# Altium schematic sheet STM32L476VE.SchDoc
size A3; ApprovedBy: WEILIANG; Author: WU&WEILIANG; Address1: NANJING; Address2: TAIYUAN
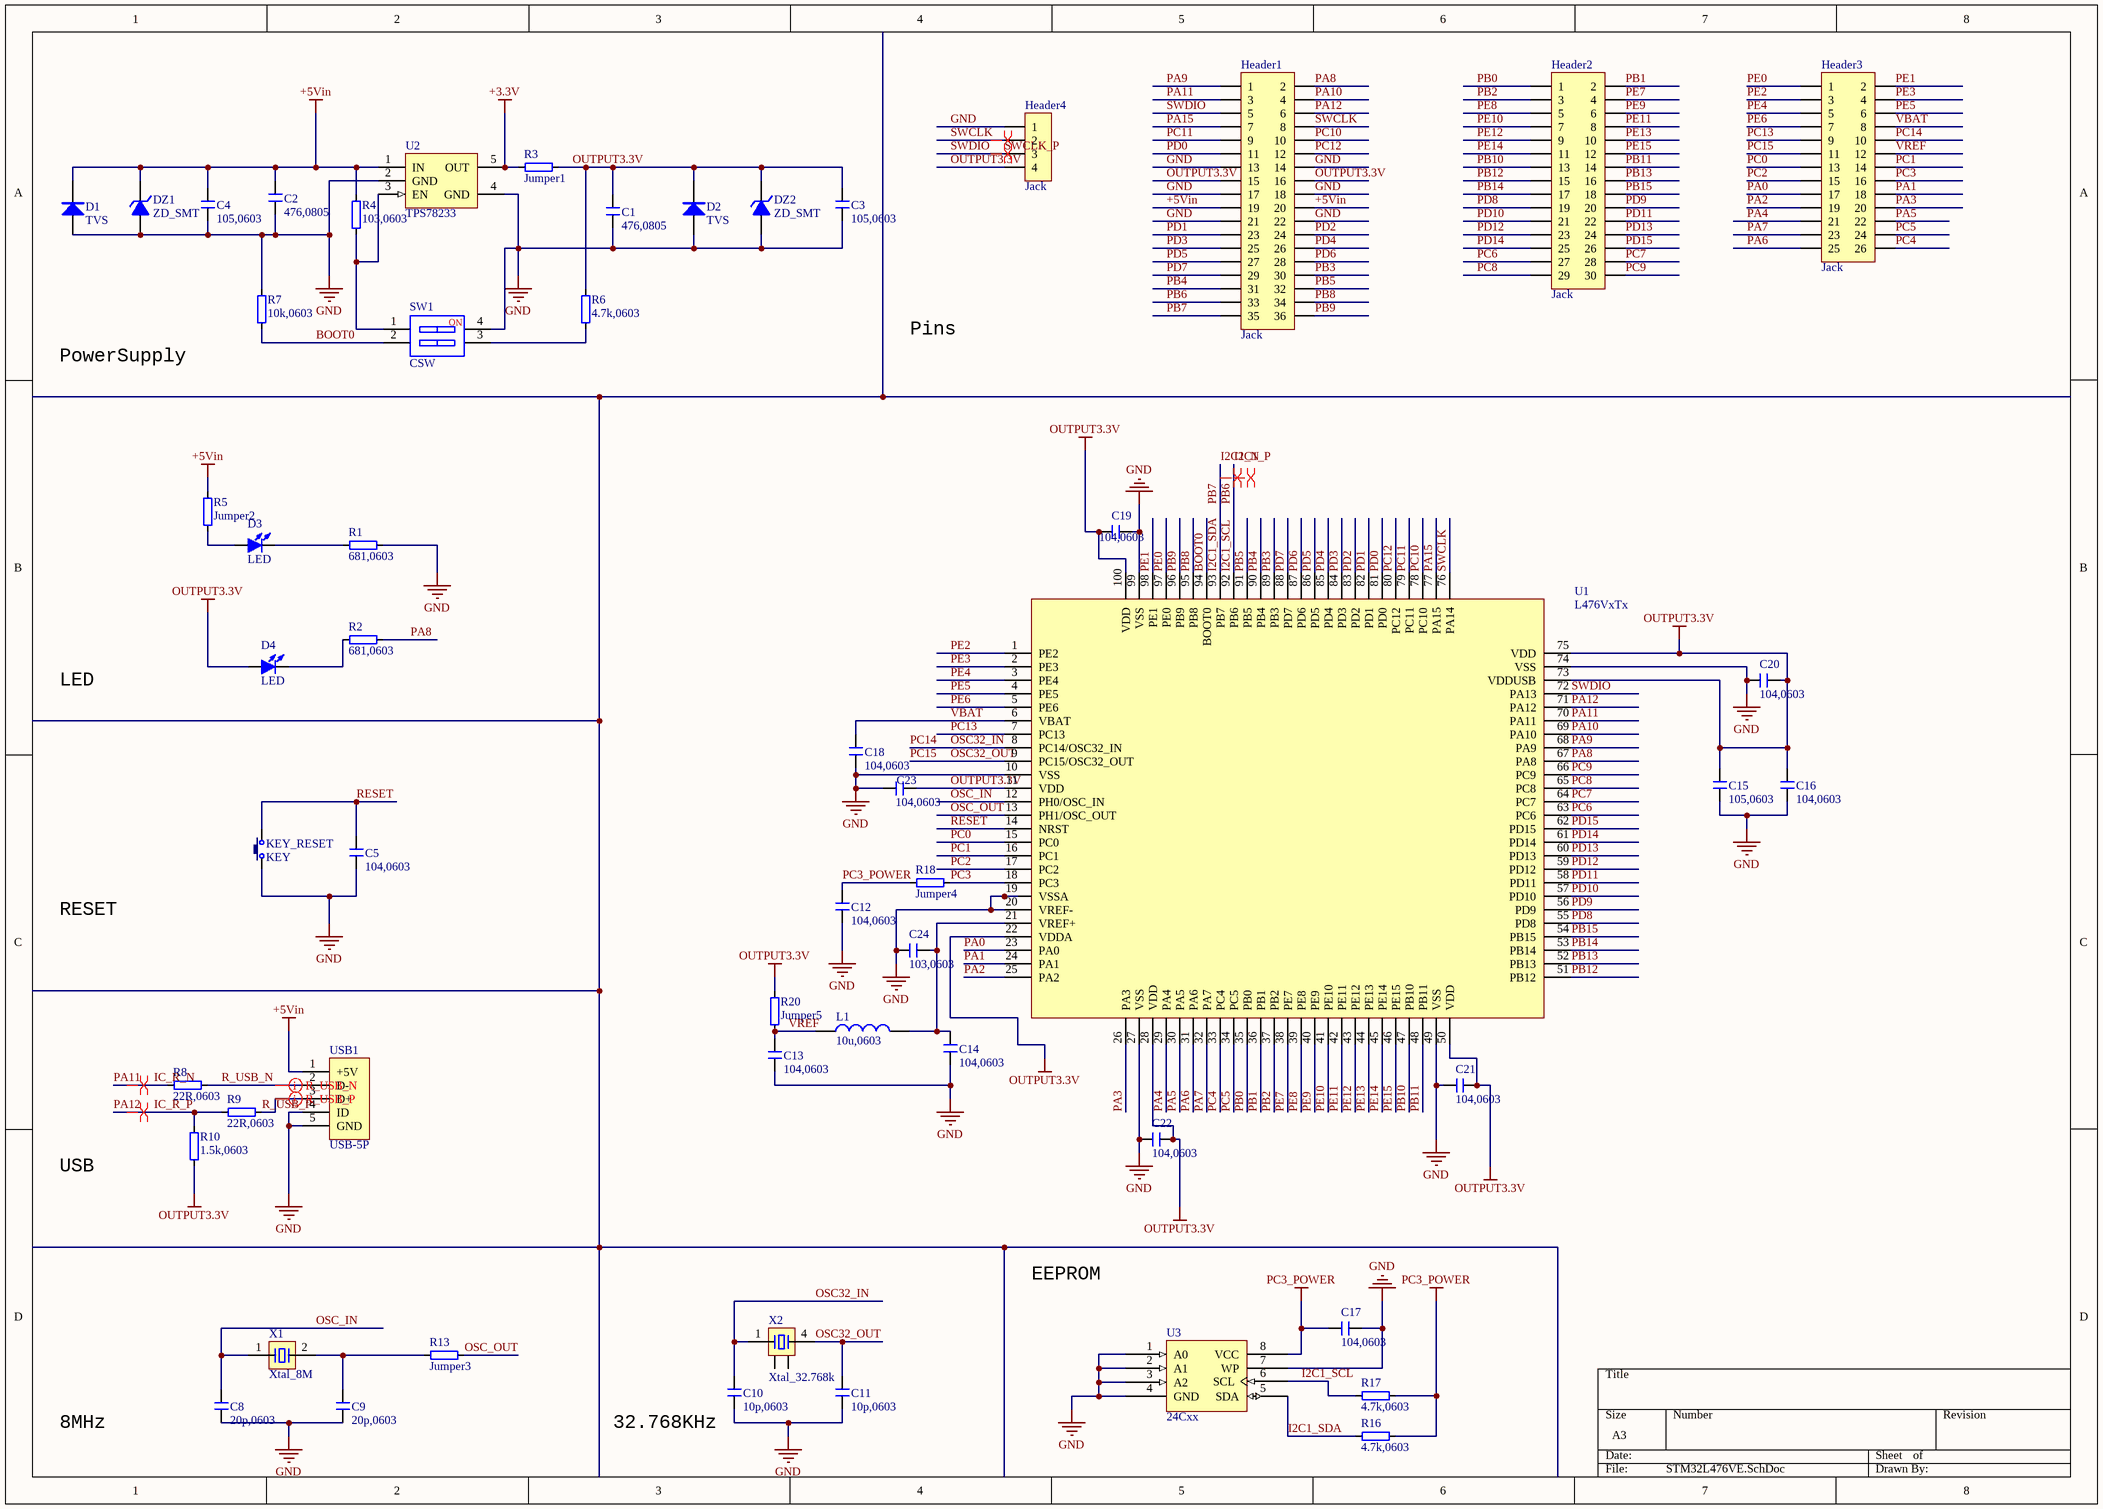
[diagram p0: STM32L476VE.SchDoc]

## Parts
C1  476,0805  [0805C]
C2  476,0805  [0805C]
C3  105,0603  [0603_R]
C4  105,0603  [0603_R]
C5  104,0603  [0603_R]
C8  20p,0603  [0603_R]
C9  20p,0603  [0603_R]
C10  10p,0603  [0603_R]
C11  10p,0603  [0603_R]
C12  104,0603  [0603_R]
C13  104,0603  [0603_R]
C14  104,0603  [0603_R]
C15  105,0603  [0603_R]
C16  104,0603  [0603_R]
C17  104,0603  [0603_R]
C18  104,0603  [0603_R]
C19  104,0603  [0603_R]
C20  104,0603  [0603_R]
C21  104,0603  [0603_R]
C22  104,0603  [0603_R]
C23  104,0603  [0603_R]
C24  103,0603  [0603_R]
D1  TVS  [SMB(DO-214AA)_S3]
D2  TVS  [SMB(DO-214AA)_S3]
D3  LED  [LED0603]
D4  LED  [LED0603]
DZ1  ZD_SMT  [MINI_MELF (LL34)]
DZ2  ZD_SMT  [MINI_MELF (LL34)]
Header1  Jack  [HDR2.54-LI-2x18P]
Header2  Jack  [HDR2.54-LI-2x15P]
Header3  Jack  [HDR2.54-LI-2x13P]
Header4  Jack  [HDR2.54-LI-4P]
KEY_RESET  KEY  [TSW SMD-4*4*1.5]
L1  10u,0603  [L 0603]
R1  681,0603  [0603_R]
R2  681,0603  [0603_R]
R3  Jumper1  [0805C]
R4  103,0603  [0603_R]
R5  Jumper2  [0603_R]
R6  4.7k,0603  [0603_R]
R7  10k,0603  [0603_R]
R8  22R,0603  [0603_R]
R9  22R,0603  [0603_R]
R10  1.5k,0603  [0603_R]
R13  Jumper3  [0603_R]
R16  4.7k,0603  [0603_R]
R17  4.7k,0603  [0603_R]
R18  Jumper4  [0603_R]
R20  Jumper5  [0603_R]
SW1  CSW  [CSW1.27 SMD-2P]
U1  L476VxTx  [LQFP-100_14x14x05P]
U2  TPS78233  [SOT23-5L]
U3  24Cxx  [SOIC-8_150mil]
USB1  USB-5P  [USB-MICRO_E]
X1  Xtal_8M  [SMD-5032_2P]
X2  Xtal_32.768k  [OSC MC-306]

## Nets
+3.3V: R3.1 U2.5(OUT)
+5Vin: C2.1 C4.1 D1.2(K) DZ1.2(K) Header1.19 Header1.20 R4.2 R5.2 U2.1(IN) USB1.1(+5V)
GND: C1.2 C2.2 C3.2 C4.2 C5.2 C8.2 C9.2 C10.2 C11.2 C12.2 C13.2 C14.2 C15.2 C16.2 C17.2 C18.2 C19.2 C20.1 C21.1 C22.1 C23.2 C24.1 D1.1(A) D2.1(A) DZ1.1(A) DZ2.1(A) Header1.13 Header1.14 Header1.17 Header1.18 Header1.21 Header1.22 Header4.1 KEY_RESET.1 R1.2 R7.1 SW1.4 U1.10(VSS) U1.19(VSSA) U1.20(VREF-) U1.27(VSS) U1.49(VSS) U1.74(VSS) U1.99(VSS) U2.2(GND) U2.4(GND) U3.1(A0) U3.2(A1) U3.3(A2) U3.4(GND) U3.7(WP) USB1.4(ID) USB1.5(GND)
OUTPUT3.3V: C1.1 C3.1 C15.1 C16.1 C19.1 C20.2 C21.2 C22.2 C23.1 D2.2(K) D4.1(A) DZ2.2(K) Header1.15 Header1.16 Header4.4 R3.2 R6.2 R10.1 R20.2 U1.11(VDD) U1.22(VDDA) U1.28(VDD) U1.50(VDD) U1.73(VDDUSB) U1.75(VDD) U1.100(VDD)
PC3_POWER: C12.1 C17.1 R16.2 R17.2 R18.1 U3.8(VCC)
BOOT0: R7.2 SW1.2 U1.94(BOOT0)
I2C1_N: Header1.35 R16.1 U1.93(PB7) U3.5(SDA)  [also labelled I2C1_SDA, PB7]
I2C1_P: Header1.33 R17.1 U1.92(PB6) U3.6(SCL)  [also labelled I2C1_SCL, PB6]
IC_R_N: Header1.3 R8.1 U1.70(PA11)  [also labelled PA11]
IC_R_P: Header1.6 R9.1 R10.2 U1.71(PA12)  [also labelled PA12]
OSC32_IN: C10.1 Header3.10 U1.8(PC14/OSC32_IN) X2.1  [also labelled PC14]
OSC32_OUT: C11.1 Header3.11 U1.9(PC15/OSC32_OUT) X2.4  [also labelled PC15]
OSC_IN: C8.1 U1.12(PH0/OSC_IN) X1.1
OSC_OUT: R13.2 U1.13(PH1/OSC_OUT)
PA0: Header3.17 U1.23(PA0)
PA1: Header3.18 U1.24(PA1)
PA2: Header3.19 U1.25(PA2)
PA3: Header3.20 U1.26(PA3)
PA4: Header3.21 U1.29(PA4)
PA5: Header3.22 U1.30(PA5)
PA6: Header3.25 U1.31(PA6)
PA7: Header3.23 U1.32(PA7)
PA8: Header1.2 R2.2 U1.67(PA8)
PA9: Header1.1 U1.68(PA9)
PA10: Header1.4 U1.69(PA10)
PA15: Header1.7 U1.77(PA15)
PB0: Header2.1 U1.35(PB0)
PB1: Header2.2 U1.36(PB1)
PB2: Header2.3 U1.37(PB2)
PB3: Header1.30 U1.89(PB3)
PB4: Header1.31 U1.90(PB4)
PB5: Header1.32 U1.91(PB5)
PB8: Header1.34 U1.95(PB8)
PB9: Header1.36 U1.96(PB9)
PB10: Header2.13 U1.47(PB10)
PB11: Header2.14 U1.48(PB11)
PB12: Header2.15 U1.51(PB12)
PB13: Header2.16 U1.52(PB13)
PB14: Header2.17 U1.53(PB14)
PB15: Header2.18 U1.54(PB15)
PC0: Header3.13 U1.15(PC0)
PC1: Header3.14 U1.16(PC1)
PC2: Header3.15 U1.17(PC2)
PC3: Header3.16 R18.2 U1.18(PC3)
PC4: Header3.26 U1.33(PC4)
PC5: Header3.24 U1.34(PC5)
PC6: Header2.27 U1.63(PC6)
PC7: Header2.28 U1.64(PC7)
PC8: Header2.29 U1.65(PC8)
PC9: Header2.30 U1.66(PC9)
PC10: Header1.10 U1.78(PC10)
PC11: Header1.9 U1.79(PC11)
PC12: Header1.12 U1.80(PC12)
PC13: Header3.9 U1.7(PC13)
PD0: Header1.11 U1.81(PD0)
PD1: Header1.23 U1.82(PD1)
PD2: Header1.24 U1.83(PD2)
PD3: Header1.25 U1.84(PD3)
PD4: Header1.26 U1.85(PD4)
PD5: Header1.27 U1.86(PD5)
PD6: Header1.28 U1.87(PD6)
PD7: Header1.29 U1.88(PD7)
PD8: Header2.19 U1.55(PD8)
PD9: Header2.20 U1.56(PD9)
PD10: Header2.21 U1.57(PD10)
PD11: Header2.22 U1.58(PD11)
PD12: Header2.23 U1.59(PD12)
PD13: Header2.24 U1.60(PD13)
PD14: Header2.25 U1.61(PD14)
PD15: Header2.26 U1.62(PD15)
PE0: Header3.1 U1.97(PE0)
PE1: Header3.2 U1.98(PE1)
PE2: Header3.3 U1.1(PE2)
PE3: Header3.4 U1.2(PE3)
PE4: Header3.5 U1.3(PE4)
PE5: Header3.6 U1.4(PE5)
PE6: Header3.7 U1.5(PE6)
PE7: Header2.4 U1.38(PE7)
PE8: Header2.5 U1.39(PE8)
PE9: Header2.6 U1.40(PE9)
PE10: Header2.7 U1.41(PE10)
PE11: Header2.8 U1.42(PE11)
PE12: Header2.9 U1.43(PE12)
PE13: Header2.10 U1.44(PE13)
PE14: Header2.11 U1.45(PE14)
PE15: Header2.12 U1.46(PE15)
R_USB_N: R8.2 USB1.2(D-)
R_USB_P: R9.2 USB1.3(D+)
RESET: C5.1 KEY_RESET.2 U1.14(NRST)
SWCLK: Header1.8 Header4.2 U1.76(PA14)
SWCLK_P: Header1.5 Header4.3 U1.72(PA13)  [also labelled SWDIO]
VBAT: C18.1 Header3.8 U1.6(VBAT)
VREF: C13.1 Header3.12 L1.1 R20.1
NetC9_1: C9.1 R13.1 X1.2
NetC14_1: C14.1 C24.2 L1.2 U1.21(VREF+)
NetD3_1: D3.1(A) R5.1
NetD3_2: D3.2(K) R1.1
NetD4_2: D4.2(K) R2.1
NetR4_1: R4.1 SW1.1 U2.3(EN)
NetR6_1: R6.1 SW1.3

Not connected (* = marked no-connect by the designer): X2 2 3

## Layout directives
differential pair: I2C1_N, I2C1_P, IC_R_N, IC_R_P, R_USB_N, R_USB_P, SWCLK, SWCLK_P

## Notes on the sheet
- PowerSupply
- Pins
- LED
- RESET
- (near R10) USB
- (near U3) EEPROM
- 8MHz
- (near C10) 32.768KHz
- (in symbol Switch2_SMT) NO

## Library data of the parts
C1 C2 = CC_SMT_1: SMT0805
C3-C5 C8-C24 = CC_SMT: SMT0603
D1 D2 = TVS_SMT: TVS Diode; BOM名称: 肖特基二极管; 版权归属: 源创客; 属性: 40V/2A; 学习资源: www.ooocke.com
D3 D4 = LED0603: LED_0603
DZ1 DZ2 = ZD_SMT: Zener
Header1 = M_18X2Pins_2.54-DIP: Header Male
Header2 = M_15X2Pins_2.54-DIP: Header Male
Header3 = M_13X2Pins_2.54-DIP: Header Male
Header4 = M_4Pins_2.54-DIP: Header Male
KEY_RESET = TSW_4x4-SMT: Tact Switch
L1 = L_SMT: SMT_0603
R1 R2 R4-R10 R13 R16-R18 R20 = R_SMT: SMT_0603
R3 = R_SMT_1: SMT_0805
SW1 = Switch2_SMT: DialSwitch
U1 = STM32L476VxTx
U2 = TPS782: Regulator_SMT; BOM名称: 可调升压芯片; 版权归属: 源创客; 学习资源: www.ooocke.com
U3 = 24Cxx: 外置EEPROM; 版权归属: 源创客; BOM名称: 外置EEPROM; 学习资源: www.ooocke.com
USB1 = USB-5P: USB_SMT; BOM名称: 微型USB母座; 版权归属: 源创客; 学习资源: www.ooocke.com
X1 = XTAL_8M_SMT: BOM名称: 4脚无源晶振; 版权归属: 源创客; 学习资源: www.ooocke.com
X2 = XTAL_32.768K_SMT: BOM名称: 2脚无源脚晶振; 版权归属: 源创客; 学习资源: www.ooocke.com